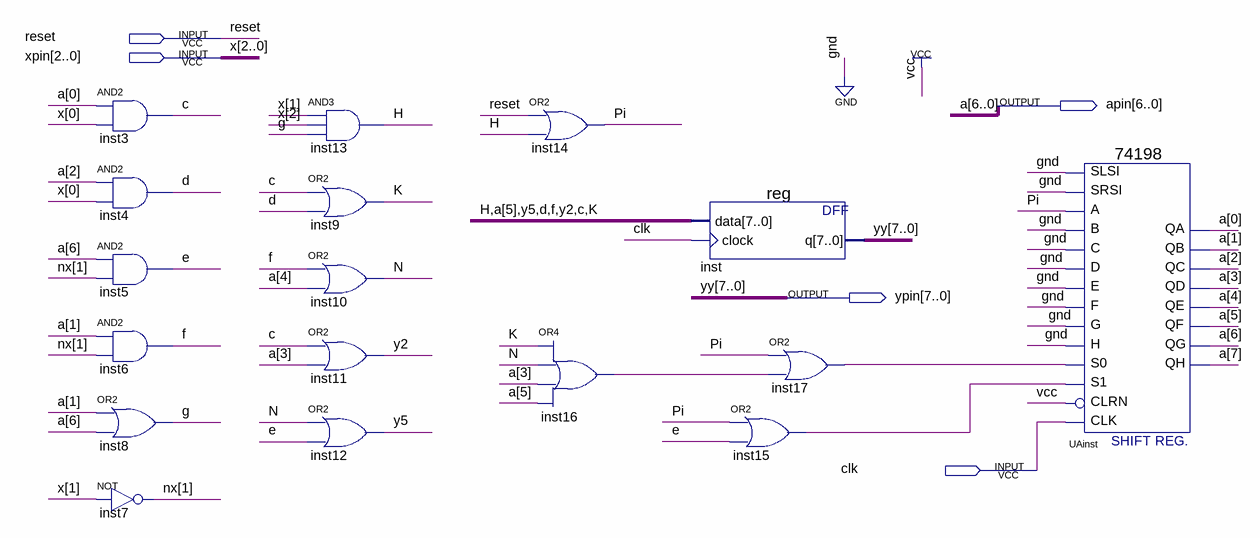
[diagram p0: schematic sheet]
// Quartus schematic projectMarUU.bdf as structural Verilog: 17 symbols, 5 pins
module projectMarUU (
  input  reset,
  input  [2:0] xpin,
  input  clk,
  output [6:0] apin,
  output [7:0] ypin
);

  wire c, d, e, f, g, H, inst15_out, inst16_out, inst17_out, K, N, Pi, y2, y5;
  wire [1:1] nx;
  wire [7:7] a;

  and inst3 (c, apin[0], xpin[0]);
  and inst4 (d, apin[2], xpin[0]);
  and inst5 (e, apin[6], nx[1]);
  and inst6 (f, apin[1], nx[1]);
  or inst8 (g, apin[1], apin[6]);
  not inst7 (nx[1], xpin[1]);
  and inst13 (H, xpin[1], xpin[2], g);
  or inst9 (K, c, d);
  or inst10 (N, f, apin[4]);
  or inst11 (y2, c, apin[3]);
  or inst12 (y5, N, e);
  or inst14 (Pi, reset, H);
  or inst16 (inst16_out, K, N, apin[3], apin[5]);
  \reg  inst (.data({H, apin[5], y5, d, f, y2, c, K}), .clock(clk), .q(ypin));
  or inst15 (inst15_out, Pi, e);
  or inst17 (inst17_out, Pi, inst16_out);
  \74198  UAinst (
    .A(Pi), .SRSI(1'b0), .SLSI(1'b0), .E(1'b0), .S0(inst17_out), .B(1'b0), .C(1'b0), .D(1'b0), .H(1'b0),
    .G(1'b0), .CLRN(1'b1), .CLK(clk), .F(1'b0), .S1(inst15_out), .QD(apin[3]), .QC(apin[2]), .QH(a[7]),
    .QA(apin[0]), .QB(apin[1]), .QE(apin[4]), .QF(apin[5]), .QG(apin[6]));

  // Other names for the same wires on the sheet: a[6:0] = apin; x[2:0] = xpin; yy[7:0] = ypin
endmodule
